# EasyEDA Pro project ProPrj_25电赛_2025-08-03-final.epro, board PCB2
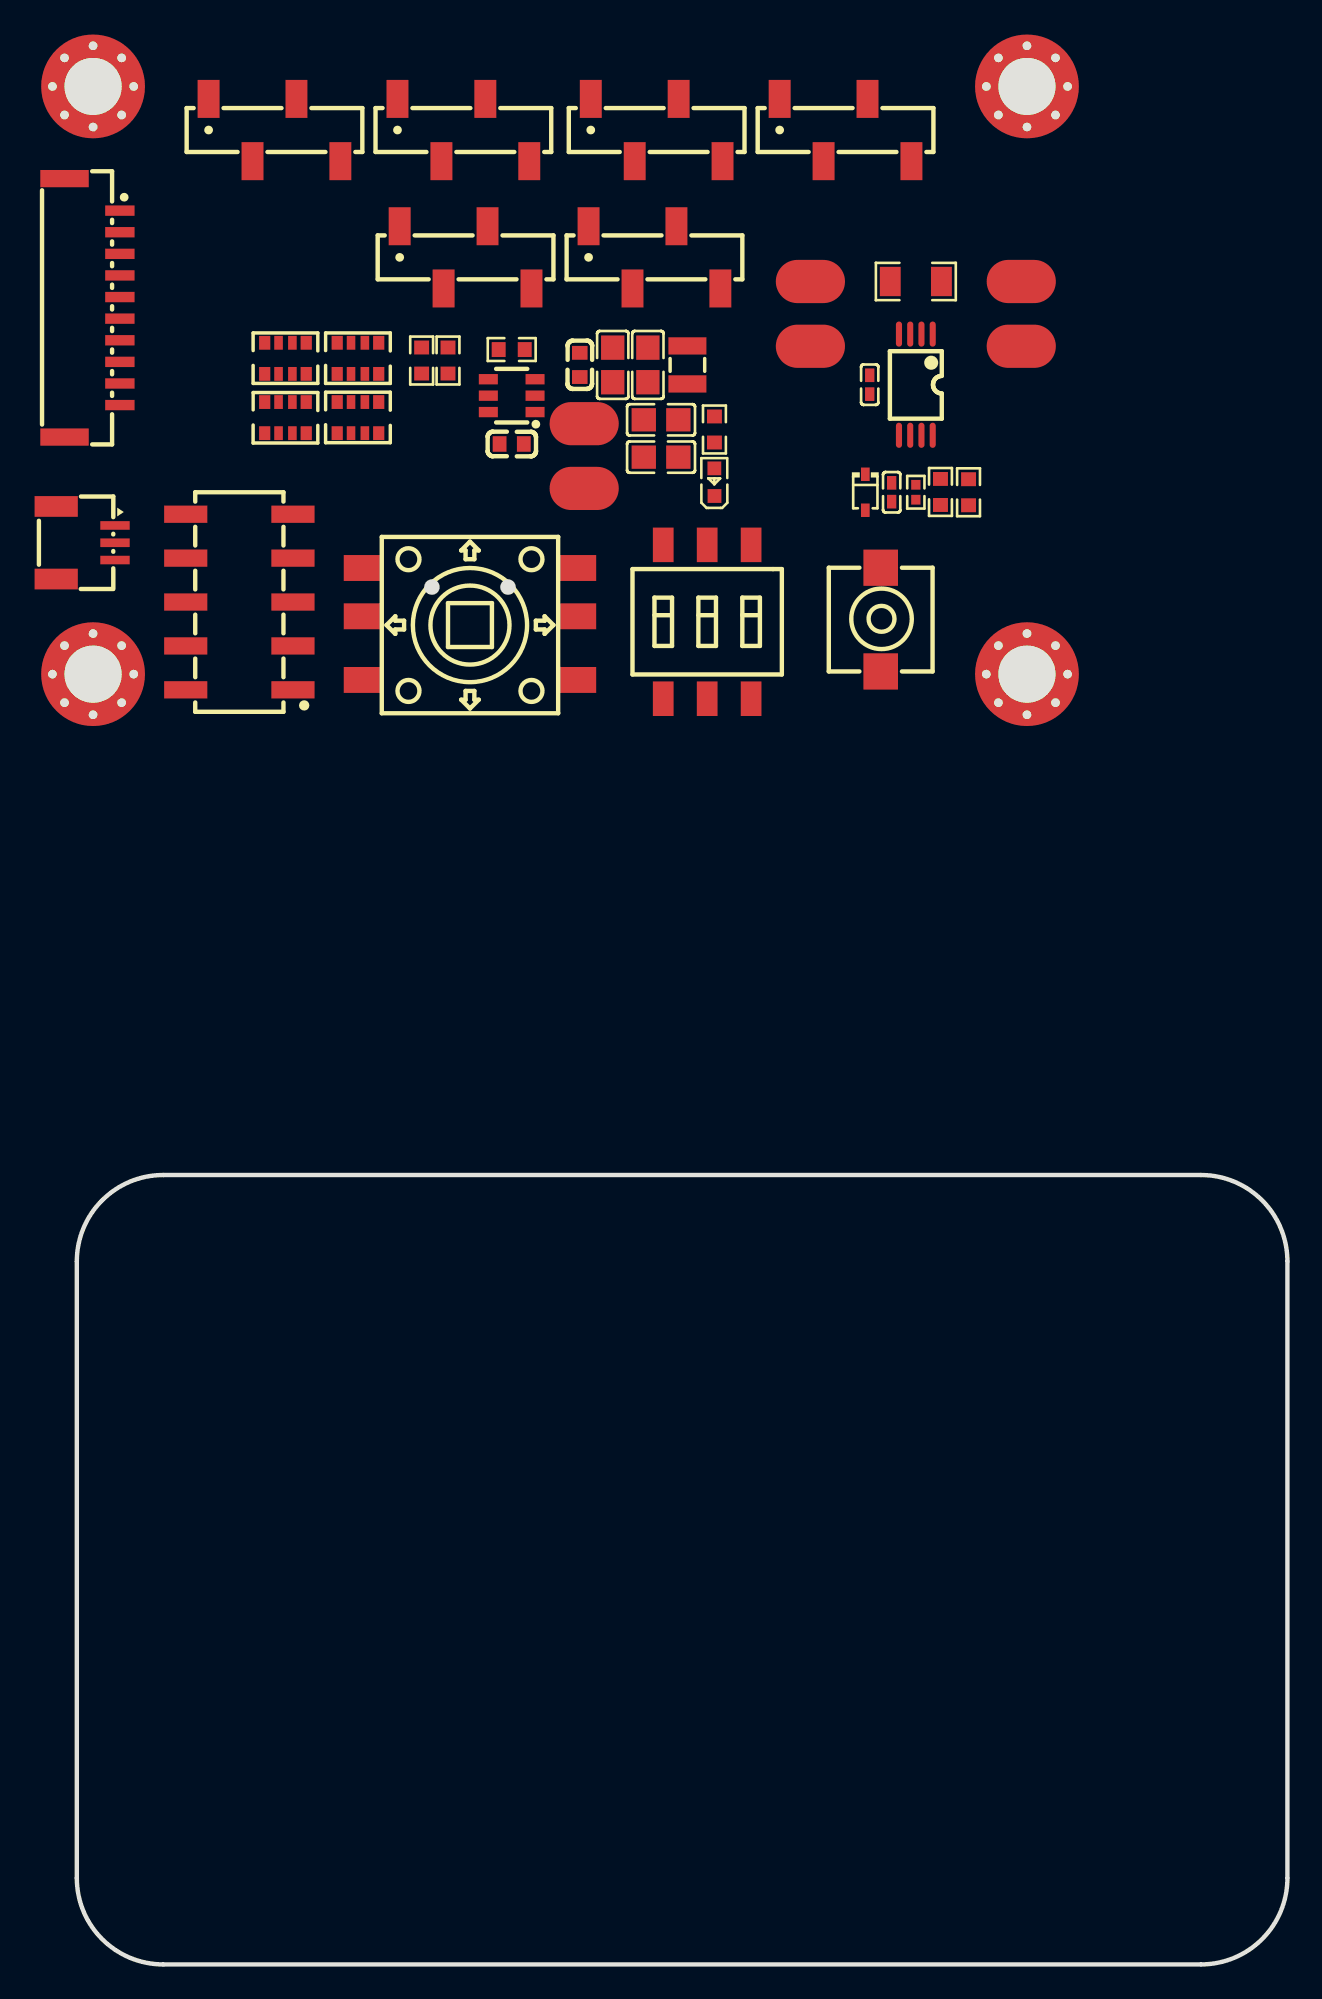
[diagram p4: board, top side]
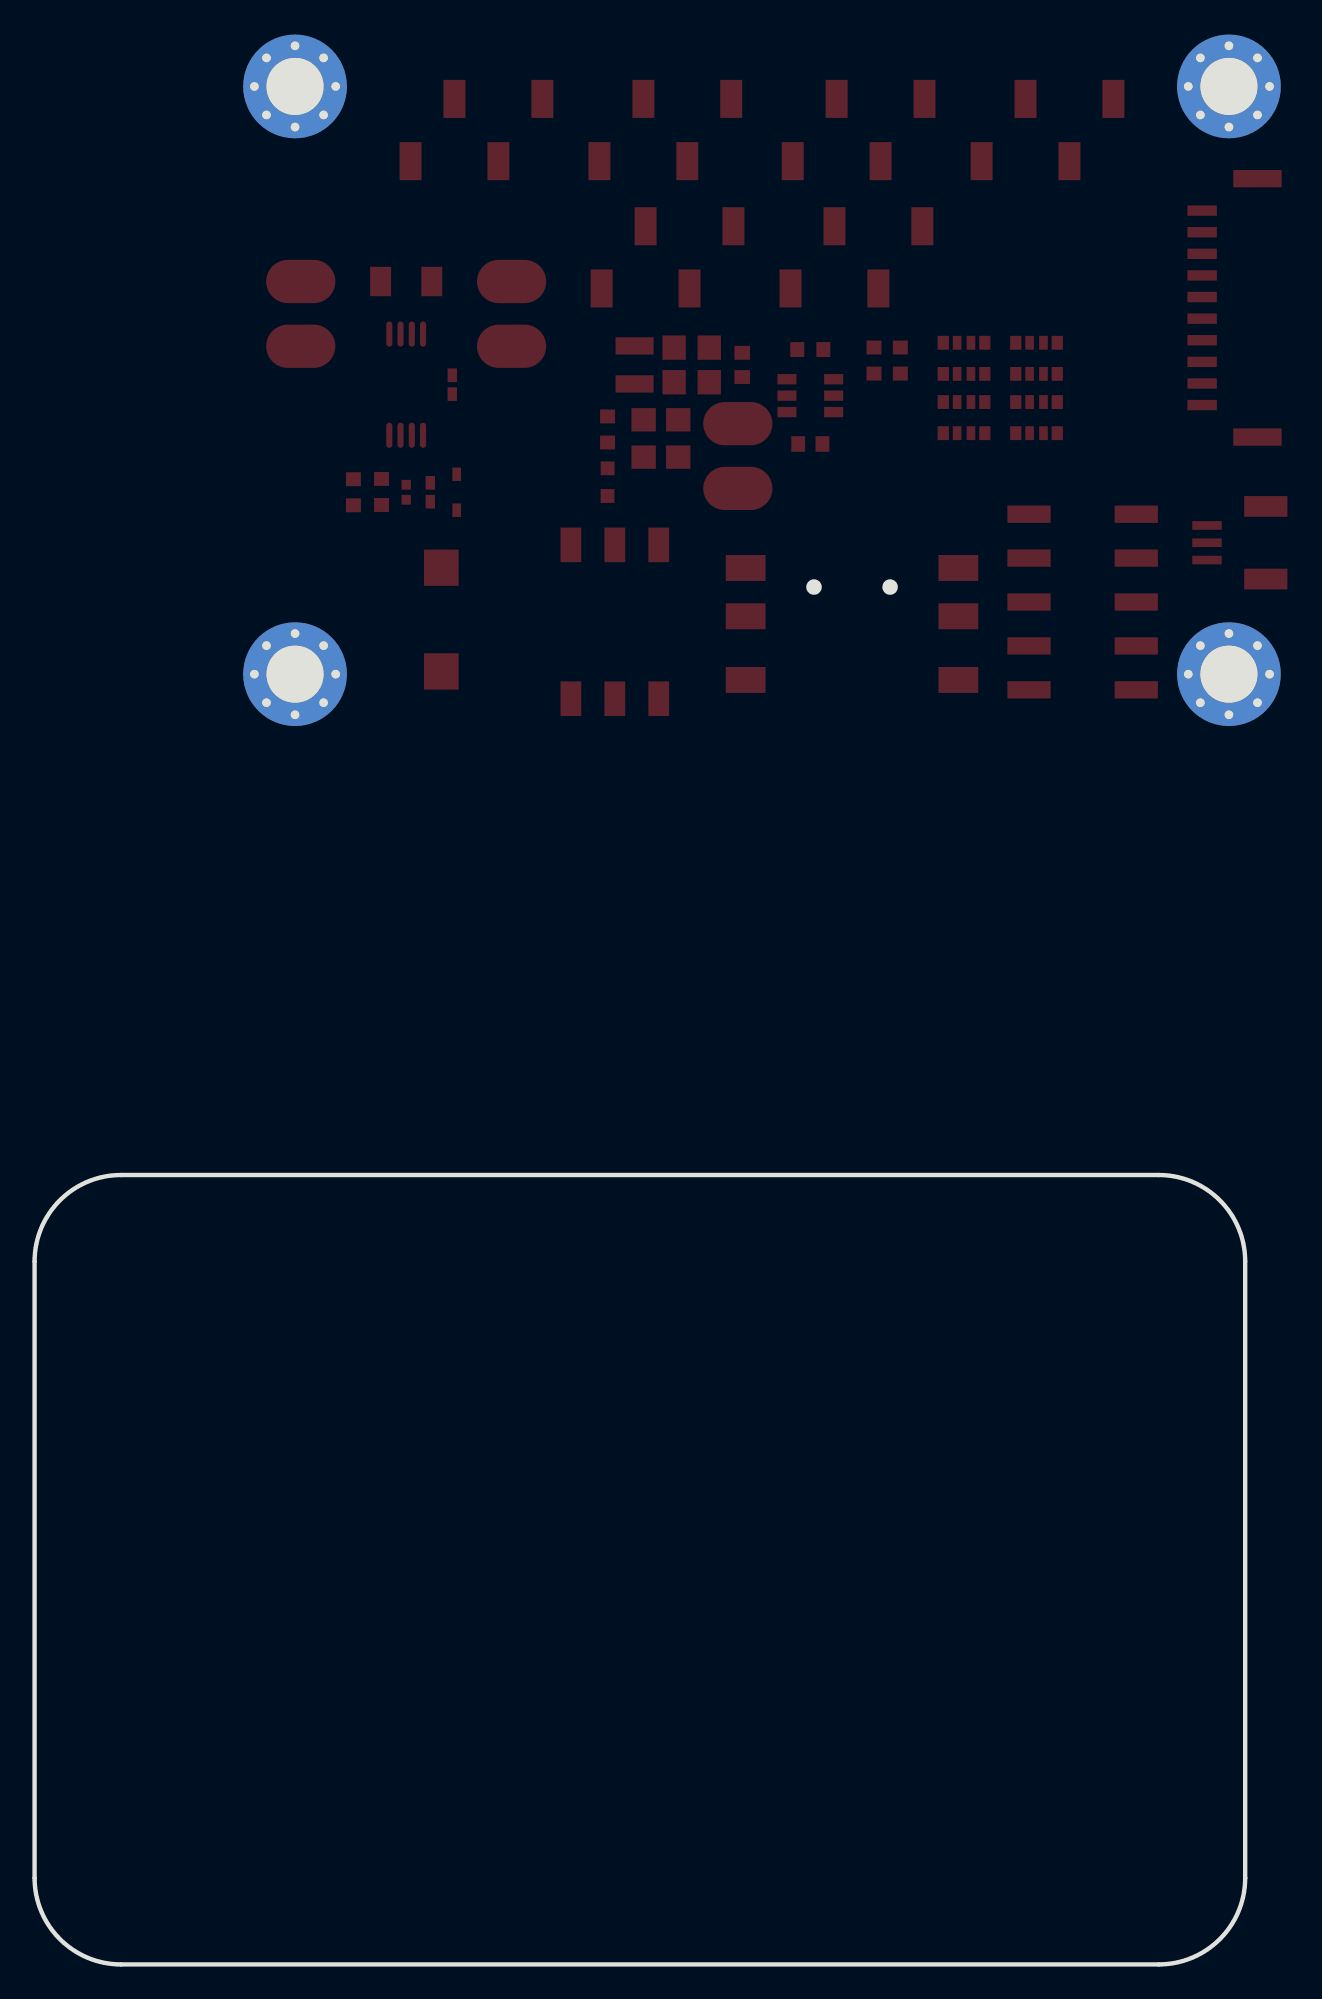
[diagram p5: board, bottom side, seen from below]

Outline 70 x 80.13 mm; copper layers: Top Layer, Bottom Layer. Coordinates in mm from the lower left corner of the outline.
Outline path: 0,40.67 0,5 arc(1.46,1.46) 5,0 65,0 arc(68.54,1.46) 70,5 70,40.67 arc(68.54,44.2) 65,45.67 5,45.67 arc(1.46,44.2) 0,40.67
Stack: Top Layer 0.035mm / Dielectric1 1.51mm FR4 er 4.5 / Bottom Layer 0.035mm

## Design rules (mm)
template: JLCPCB Capability(Two Layers Board)
spacing copperThickness1oz (default): track to track 0.102, other pairs 0.152 to 0.3
spacing copperThickness2oz: track to track 0.203, other pairs 0.152 to 0.3
track width copperThickness1oz (default): min 0.127, default 0.254, max 2.54
track width copperThickness2oz: min 0.203, default 0.254, max 2.54
differential pair differentialPair (default): width min 0.127, default 0.254, max 2.54; gap min 0.152, default 0.152
via viaSize (default): diameter min 0.5, default 0.61, max 10; hole min 0.3, default 0.305, max 6.3

## Placement (name value [footprint] x y rotation side)
C87  100nF  [C0603]  25.15 87.96 180 top
C88  22uF  [C0805]  33.78 87.2 0 top
C89  22uF  [C0805]  33.78 89.36 0 top
C90  10uF  [C0805]  30.99 92.53 270 top
C91  10uF  [C0805]  33.02 92.53 270 top
C92  100nF  [C0603]  29.08 92.53 270 top
C148  100nF  [C0402]  45.85 91.39 90 top
C167  100nF  [C0402]  47.12 85.16 270 top
D31  1N4148WS  [SOD-323_L1.7-W1.3-LS2.5-FD]  45.59 85.16 90 top
H1  B-2100N10P-B110  [HDR-SMD_10P-P2.54-V-M-R2-C5-S2.54-LS7.3]  9.4 78.81 90 top
H2  X6511WVS-04H-C60D48R1  [HDR-SMD_4P-P2.54-V-M-S4.8]  33.4 98.75 0 top
H3  X6511WVS-04H-C60D48R1  [HDR-SMD_4P-P2.54-V-M-S4.8]  22.48 98.75 0 top
H4  X6511WVS-04H-C60D48R1  [HDR-SMD_4P-P2.54-V-M-S4.8]  44.45 106.12 0 top
H5  X6511WVS-04H-C60D48R1  [HDR-SMD_4P-P2.54-V-M-S4.8]  33.53 106.12 0 top
H6  X6511WVS-04H-C60D48R1  [HDR-SMD_4P-P2.54-V-M-S4.8]  11.43 106.12 0 top
H7  X6511WVS-04H-C60D48R1  [HDR-SMD_4P-P2.54-V-M-S4.8]  22.35 106.12 0 top
J1  -  [M3螺帽]  0.94 74.64 0 top
J3  -  [M3螺帽]  54.94 74.64 0 top
J4  -  [M3螺帽]  0.94 108.64 0 top
J5  -  [M3螺帽]  54.94 108.64 0 top
L5  2.2uH  [IND-SMD_L2.5-W2.0_MHCHL2520]  35.31 92.53 90 top
LED7  NCD0603R1  [LED0603-RD_RED]  36.87 85.75 90 top
R135  4.7K  [R0603]  36.87 88.8 90 top
R136  10kΩ  [R0603]  25.15 93.42 180 top
R137  10kΩ  [R0603]  19.94 92.78 90 top
R138  33.2kΩ  [R0603]  21.46 92.78 90 top
R189  10mΩ  [R1206]  48.51 97.36 0 top
R196  150kΩ  [R0402]  48.51 85.16 270 top
R198  0Ω  [R0603]  51.56 85.16 90 top
R199  0Ω  [R0603]  49.94 85.18 270 top
RN3  100Ω  [RES-ARRAY-SMD_0603-8P-L3.2-W1.6-BL]  16.26 89.48 0 top
RN4  100Ω  [RES-ARRAY-SMD_0603-8P-L3.2-W1.6-BL]  12.06 89.48 180 top
RN5  1kΩ  [RES-ARRAY-SMD_0603-8P-L3.2-W1.6-BL]  16.26 92.91 0 top
RN6  1kΩ  [RES-ARRAY-SMD_0603-8P-L3.2-W1.6-BL]  12.06 92.91 0 top
SW3  DSIC03LS-P  [SW-SMD_6P-L8.6-W6.2-P2.54-LS9.8]  36.45 77.67 0 top
SW5  K1-1504SA-06  [SW-SMD_K1-1504SA-06]  22.73 77.55 0 top
U32  TPS563201DDCR  [SOT-23-6_L2.9-W1.6-P0.95-LS2.8-BR]  25.15 90.75 0 top
U60  -  [2P焊接端子（大电流）]  29.34 87.26 180 top
U61  INA240A2PWR  [TSSOP-8_L4.4-W3.0-P0.65-LS6.4-BL]  48.51 91.39 180 top
U65  -  [2P焊接端子（大电流）]  42.42 95.48 0 top
U72  SKPMAQE010  [KEY-SMD_2P-L6.0-W6.0-P6.00]  46.48 77.8 270 top
U73  WAFER-GH1.25-10PWB  [CONN-SMD_10P-P1.25_XUNPU_WAFER-GH1.25-10PWB]  0.89 95.83 270 top
U74  -  [2P焊接端子（大电流）]  54.61 95.48 0 top
U75  ZX-SH1.0-3PWT  [CONN-SMD_3P-P1.00_MEGASTAR_ZX-SH1.0-3PWT]  0.51 82.24 270 top

## Footprints (pads in the part's own frame, mm; a bottom-side part is the same pattern mirrored in y, then rotated)
2P焊接端子（大电流）
  oval 4x2.5 smd: 1(0,1.873) 2(0,-1.873)
C0402
  rect 0.79x0.54 smd: 1(-0.545,0) 2(0.545,0)
C0603
  rect 0.8x0.9 smd: 1(-0.7,0) 2(0.7,0)
C0805
  rect 1.41x1.35 smd: 1(-1,0) 2(1,0)
CONN-SMD_3P-P1.00_MEGASTAR_ZX-SH1.0-3PWT
  rect 0.5x1.7 smd: 1(-1,1.7) 2(0,1.7) 3(1,1.7)
  rect 1.2x2.5 smd: 4(-2.1,-1.7) 5(2.1,-1.7)
CONN-SMD_10P-P1.25_XUNPU_WAFER-GH1.25-10PWB
  rect 0.6x1.7 smd: 1(-5.625,1.6) 2(-4.375,1.6) 3(-3.125,1.6) 4(-1.875,1.6) 5(-0.625,1.6) 6(0.625,1.6) 7(1.875,1.6) 8(3.125,1.6) 9(4.375,1.6) 10(5.625,1.6)
  rect 1x2.8 smd: 11(7.475,-1.6) 12(-7.475,-1.6)
HDR-SMD_4P-P2.54-V-M-S4.8
  rect 1.27x2.2 smd: 1(-3.81,1.8) 2(-1.27,-1.8) 3(1.27,1.8) 4(3.81,-1.8)
HDR-SMD_10P-P2.54-V-M-R2-C5-S2.54-LS7.3
  rect 1x2.5 smd: 1(-5.08,-3.1) 2(-5.08,3.1) 3(-2.54,-3.1) 4(-2.54,3.1) 5(0,-3.1) 6(0,3.1) 7(2.54,-3.1) 8(2.54,3.1) 9(5.08,-3.1) 10(5.08,3.1)
IND-SMD_L2.5-W2.0_MHCHL2520
  rect 1x2.2 smd: 1(-1.1,0) 2(1.1,0)
KEY-SMD_2P-L6.0-W6.0-P6.00
  rect 2.1x2 smd: 1(-3,0) 2(3,0)
LED0603-RD_RED
  rect 0.8x0.8 smd: 1(-0.799,-0.004) 2(0.799,0.004)
M3螺帽
  round 6 hole 3.302: 1(0,0)
  round 1 hole 0.5: 2(0,2.349) 3(0,-2.349) 4(2.349,0) 5(-2.349,0) 6(1.651,1.651) 7(-1.651,-1.651) 8(1.651,-1.651) 9(-1.651,1.651)
R0402
  rect 0.566x0.54 smd: 1(-0.433,0) 2(0.433,0)
R0603
  rect 0.806x0.864 smd: 1(-0.753,0) 2(0.753,0)
R1206
  rect 1.208x1.701 smd: 1(-1.479,0) 2(1.479,0)
RES-ARRAY-SMD_0603-8P-L3.2-W1.6-BL
  rect 0.65x0.8 smd: 1(-1.2,-0.9) 4(1.2,-0.9) 5(1.2,0.9) 8(-1.2,0.9)
  rect 0.5x0.8 smd: 2(-0.4,-0.9) 3(0.4,-0.9) 6(0.4,0.9) 7(-0.4,0.9)
SOD-323_L1.7-W1.3-LS2.5-FD
  rect 0.78x0.5 smd: 1(-1.04,0) 2(1.04,0)
SOT-23-6_L2.9-W1.6-P0.95-LS2.8-BR
  rect 1.1x0.6 smd: 1(1.35,-0.95) 2(1.35,0) 3(1.35,0.95) 4(-1.35,0.95) 5(-1.35,0) 6(-1.35,-0.95)
SW-SMD_6P-L8.6-W6.2-P2.54-LS9.8
  rect 1.2x2 smd: 1(-2.54,-4.45) 2(0,-4.45) 3(2.54,-4.45) 4(2.54,4.45) 5(0,4.45) 6(-2.54,4.45)
SW-SMD_K1-1504SA-06
  rect 2.3x1.5 smd: 1(-6.15,3.239) 2(-6.15,0.445) 3(-6.15,-3.239) 4(6.15,3.239) 5(6.15,0.445) 6(6.15,-3.239)
TSSOP-8_L4.4-W3.0-P0.65-LS6.4-BL
  oval 0.353x1.454 smd: 1(-0.975,-2.927) 2(-0.325,-2.927) 3(0.325,-2.927) 4(0.975,-2.927) 5(0.975,2.927) 6(0.325,2.927) 7(-0.325,2.927) 8(-0.975,2.927)

## Nets
As in the schematic.

Pads without a net: J1 2 3 4 5 6 7 8 9; J3 2 3 4 5 6 7 8 9; J4 2 3 4 5 6 7 8 9; J5 2 3 4 5 6 7 8 9; U73 11 12; U75 2
